# Altium schematic sheet USB_keyholder.SchDoc: Наименование
size 420 x 297 mm; ApprovedBy: Утвердил; CheckedBy: Проверил; Author: Разработал; CompanyName: Организация; DrawnBy: Н.Контр; Engineer: Т.Контр; SheetNumber: 1; SheetTotal: 1; PageSetup: Record=PageOptions|CenterHorizontal=True|CenterVertical=True|PrintScale=0.94|XCorrection=1.00|YCorrection=1.00|PrintKind=1|BorderSize=5000000|LeftOffset=0|BottomOffset=0|Orientation=1|PaperLength=1000|PaperWidth=1000|Scale=100|PaperSource=7|PrintQuality=-4|MediaType=1|DitherType=10|PaperKind=A4|PrintScaleMode=1; DecimalNumber: Децимальный номер; HeadOfSector: Нач. сектора; MainDevice: Перв.примен.; Name: Наименование; DocumentName: Sheet1.SCHDOC
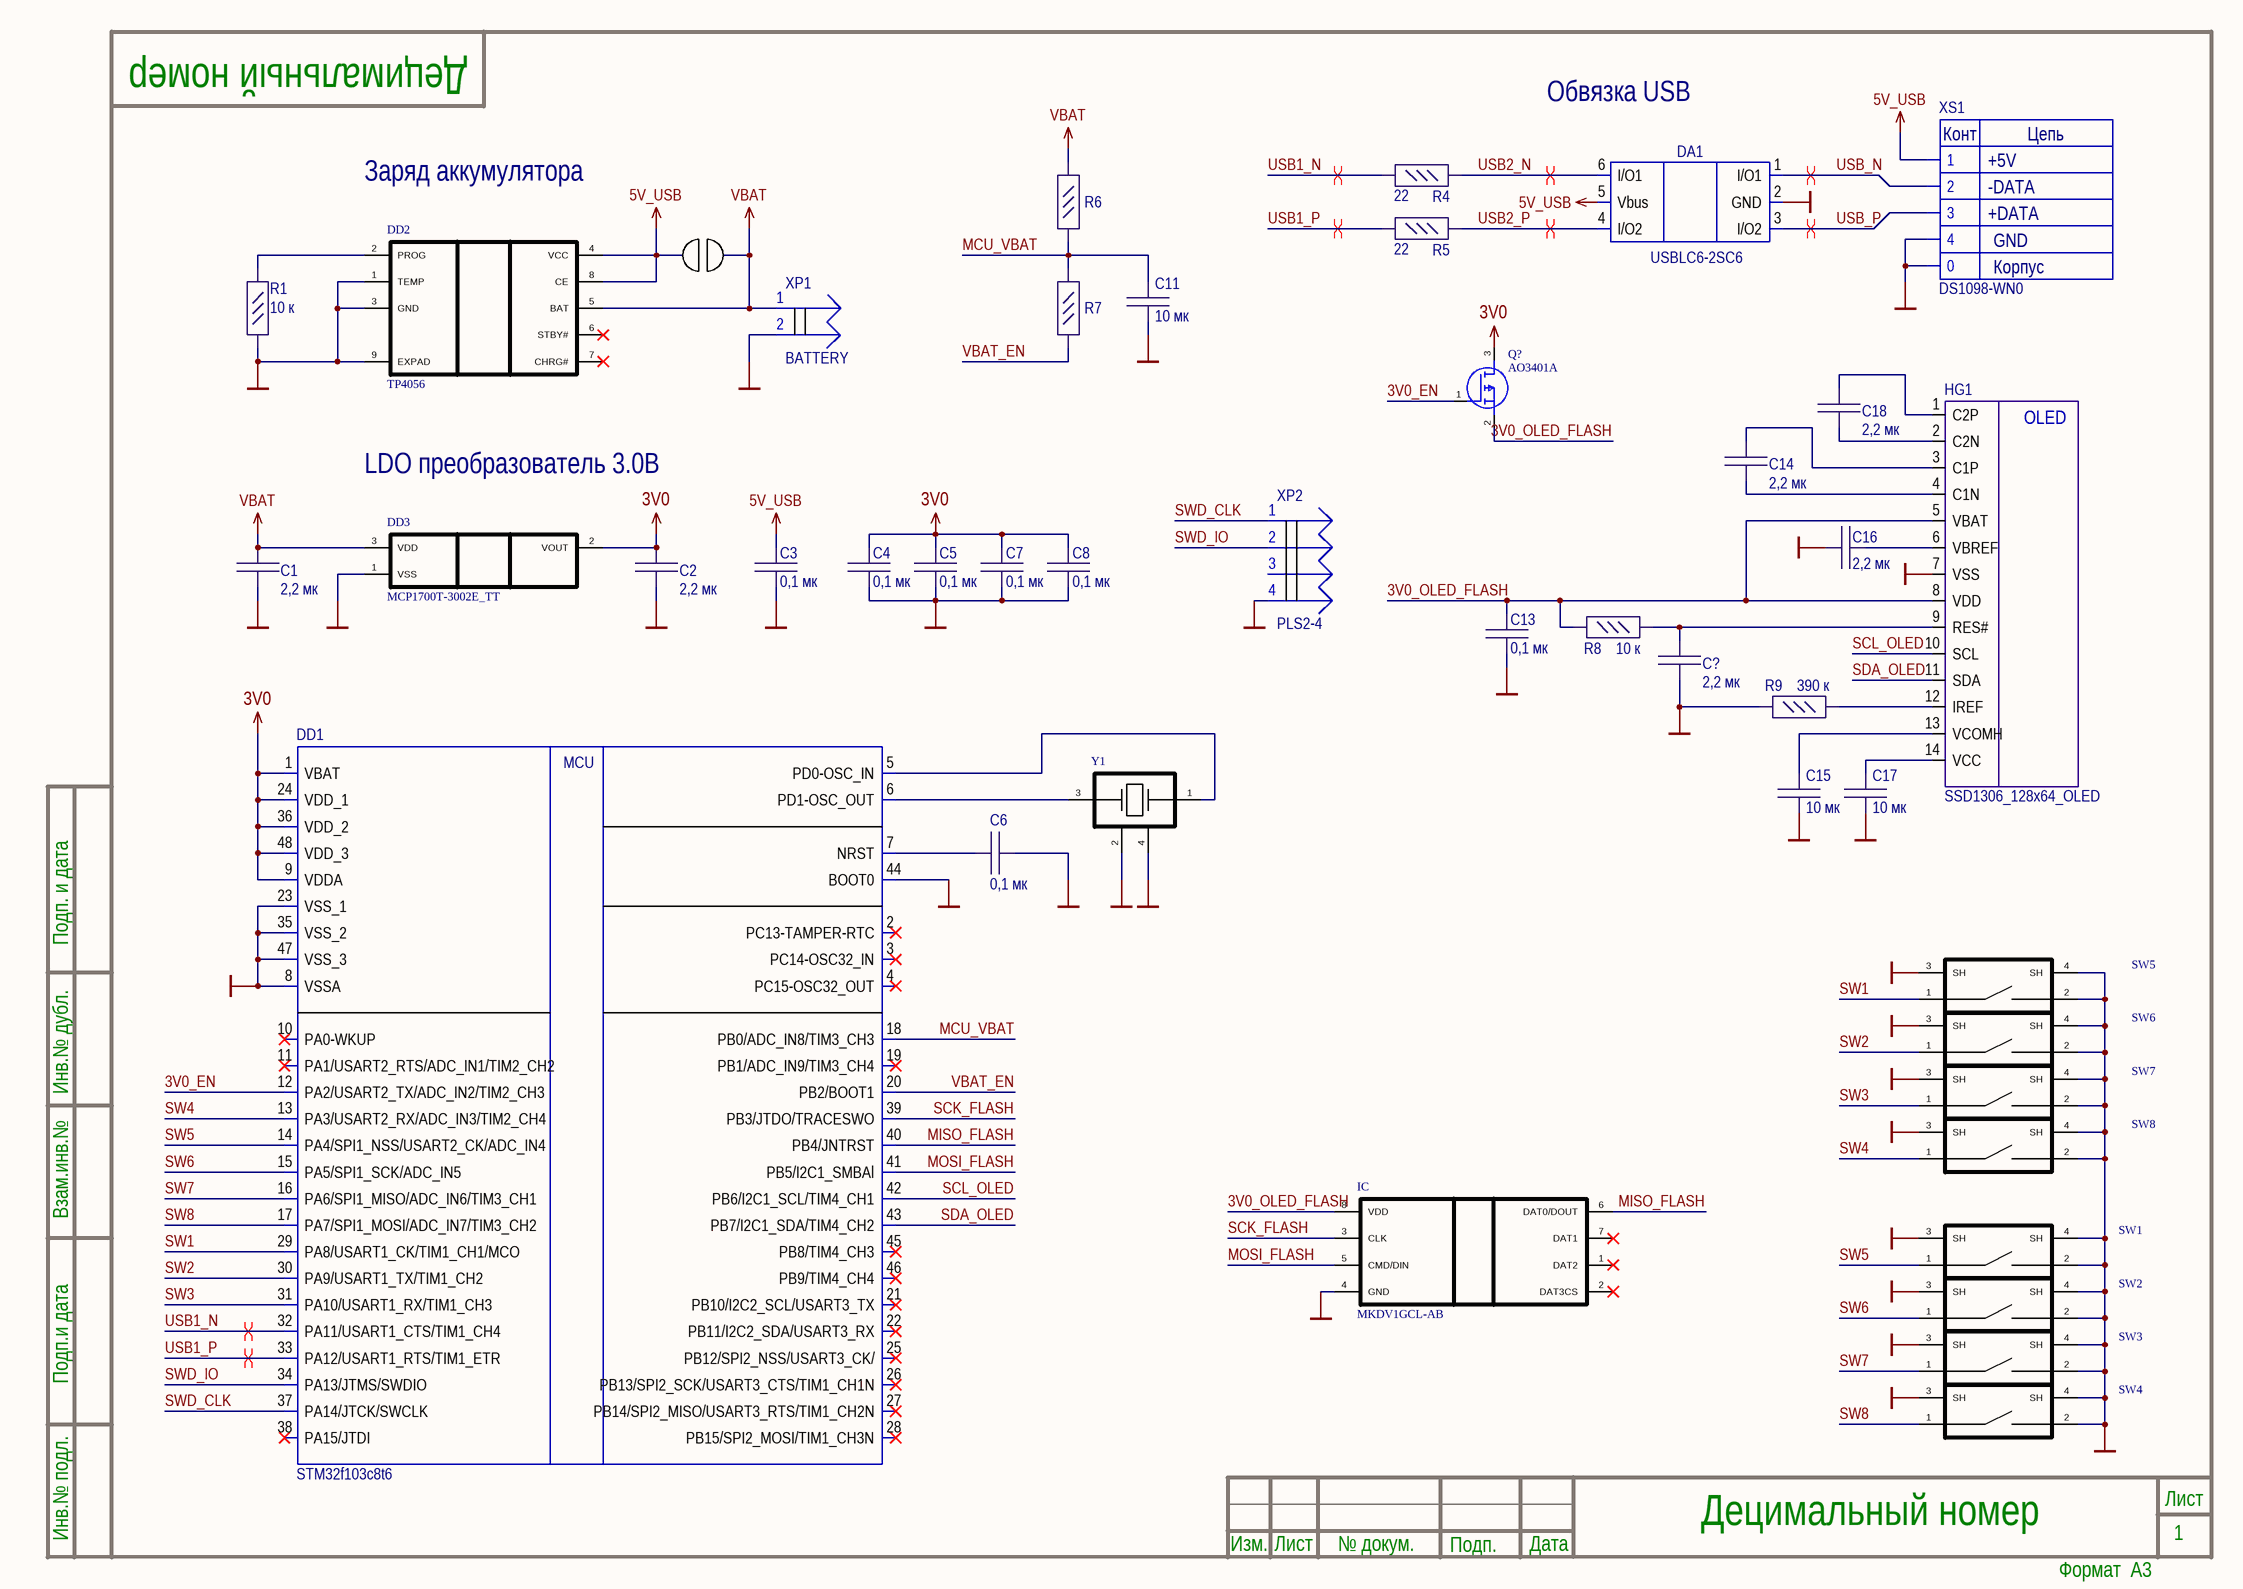
[diagram p0: USB_keyholder.SchDoc]

## Parts
C1  2,2 мк  [C_0603]
C2  2,2 мк  [C_0603]
C3  0,1 мк  [C_0603]
C4  0,1 мк  [C_0603]
C5  0,1 мк  [C_0603]
C6  0,1 мк  [C_0603]
C7  0,1 мк  [C_0603]
C8  0,1 мк  [C_0603]
C11  10 мк  [C_0603]
C13  0,1 мк  [C_0603]
C14  2,2 мк  [C_0603]
C15  10 мк  [C_0603]
C16  2,2 мк  [C_0603]
C17  10 мк  [C_0603]
C18  2,2 мк  [C_0603]
C?  2,2 мк  [C_0603]
DA1  USBLC6-2SC6  [SOT-23-6]
DD1  STM32f103c8t6  [LQFP48]
DD2  TP4056  [SOIC127P600X175-9N]
DD3  MCP1700T-3002E_TT  [SOT95P237X112-3N]
HG1  SSD1306_128х64_OLED  [14_pin_OLED]
IC  MKDV1GCL-AB  [SON127P800X600X80-8N]
Q?  AO3401A  [SOT95P280X125-3N]
R1  10 к  [R_0603]
R4  22  [R_0603]
R5  22  [R_0603]
R6  1 M  [R_0603]  (value not drawn)
R7  1 M  [R_0603]  (value not drawn)
R8  10 к  [R_0603]
R9  390 к  [R_0603]
SW1  TSA365G00D  [1TS002G26003500CT]  (value not drawn)
SW2  TSA365G00D  [1TS002G26003500CT]  (value not drawn)
SW3  TSA365G00D  [1TS002G26003500CT]  (value not drawn)
SW4  TSA365G00D  [1TS002G26003500CT]  (value not drawn)
SW5  TSA365G00D  [1TS002G26003500CT]  (value not drawn)
SW6  TSA365G00D  [1TS002G26003500CT]  (value not drawn)
SW7  TSA365G00D  [1TS002G26003500CT]  (value not drawn)
SW8  TSA365G00D  [1TS002G26003500CT]  (value not drawn)
X1  Solder_jumper  [Solder_jumper]  (value not drawn)
XP1  BATTERY  [PLS-2]
XP2  PLS2-4  [PLS2-4]
XS1  DS1098-WN0  [DS1098-WN0]
Y1  X322512MSB4SI  [X322512MSB4SI]  (value not drawn)

## Nets
3V0: C2.2 C4.2 C5.2 C7.2 C8.2 DD1.1(VBAT) DD1.9(VDDA) DD1.24(VDD_1) DD1.36(VDD_2) DD1.48(VDD_3) DD3.2(VOUT) Q?.3(D)
5V_USB: C3.2 DA1.5(Vbus) DD2.4(VCC) DD2.8(CE) X1.1 XS1.1
GND: C1.1 C2.1 C3.1 C4.1 C5.1 C6.1 C7.1 C8.1 C11.1 C13.1 C15.1 C16.2 C17.1 C?.1 DA1.2(GND) DD1.8(VSSA) DD1.23(VSS_1) DD1.35(VSS_2) DD1.44(BOOT0) DD1.47(VSS_3) DD2.1(TEMP) DD2.3(GND) DD2.9(EXPAD) DD3.1(VSS) HG1.7(VSS) IC.4(GND) R1.1 R9.1 SW1.2(VOUT) SW1.3(SH) SW1.4(SH) SW2.2(VOUT) SW2.3(SH) SW2.4(SH) SW3.2(VOUT) SW3.3(SH) SW3.4(SH) SW4.2(VOUT) SW4.3(SH) SW4.4(SH) SW5.2(VOUT) SW5.3(SH) SW5.4(SH) SW6.2(VOUT) SW6.3(SH) SW6.4(SH) SW7.2(VOUT) SW7.3(SH) SW7.4(SH) SW8.2(VOUT) SW8.3(SH) SW8.4(SH) XP1.2 XP2.4 XS1.0 XS1.4 Y1.2 Y1.4
VBAT: C1.2 DD2.5(BAT) DD3.3(VDD) R6.2 X1.2 XP1.1
3V0_EN: DD1.12(PA2/USART2_TX/ADC_IN2/TIM2_CH3) Q?.1(G)
3V0_OLED_FLASH: C13.2 HG1.5(VBAT) HG1.8(VDD) IC.8(VDD) Q?.2(S) R8.2
MCU_VBAT: C11.2 DD1.18(PB0/ADC_IN8/TIM3_CH3) R6.1 R7.2
MISO_FLASH: DD1.40(PB4/JNTRST) IC.6(DAT0/DOUT)
MOSI_FLASH: DD1.41(PB5/I2C1_SMBAl) IC.5(CMD/DIN)
SCK_FLASH: DD1.39(PB3/JTDO/TRACESWO) IC.3(CLK)
SCL_OLED: DD1.42(PB6/I2C1_SCL/TIM4_CH1) HG1.10(SCL)
SDA_OLED: DD1.43(PB7/I2C1_SDA/TIM4_CH2) HG1.11(SDA)
SW1: DD1.29(PA8/USART1_CK/TIM1_CH1/MCO) SW5.1(VSS)
SW2: DD1.30(PA9/USART1_TX/TIM1_CH2) SW6.1(VSS)
SW3: DD1.31(PA10/USART1_RX/TIM1_CH3) SW7.1(VSS)
SW4: DD1.13(PA3/USART2_RX/ADC_IN3/TIM2_CH4) SW8.1(VSS)
SW5: DD1.14(PA4/SPI1_NSS/USART2_CK/ADC_IN4) SW1.1(VSS)
SW6: DD1.15(PA5/SPI1_SCK/ADC_IN5) SW2.1(VSS)
SW7: DD1.16(PA6/SPI1_MISO/ADC_IN6/TIM3_CH1) SW3.1(VSS)
SW8: DD1.17(PA7/SPI1_MOSI/ADC_IN7/TIM3_CH2) SW4.1(VSS)
SWD_CLK: DD1.37(PA14/JTCK/SWCLK) XP2.1
SWD_IO: DD1.34(PA13/JTMS/SWDIO) XP2.2
USB1_N: DD1.32(PA11/USART1_CTS/TIM1_CH4) R4.1
USB1_P: DD1.33(PA12/USART1_RTS/TIM1_ETR) R5.1
USB2_N: DA1.6(I/O1) R4.2
USB2_P: DA1.4(I/O2) R5.2
USB_N: DA1.1(I/O1) XS1.2
USB_P: DA1.3(I/O2) XS1.3
VBAT_EN: DD1.20(PB2/BOOT1) R7.1
NetC6_2: C6.2 DD1.7(NRST)
NetC14_1: C14.1 HG1.4(C1N)
NetC14_2: C14.2 HG1.3(C1P)
NetC15_2: C15.2 HG1.13(VCOMH)
NetC16_1: C16.1 HG1.6(VBREF)
NetC17_2: C17.2 HG1.14(VCC)
NetC18_1: C18.1 HG1.2(C2N)
NetC18_2: C18.2 HG1.1(C2P)
NetC?_2: C?.2 HG1.9(RES#) R8.1
NetDD1_5: DD1.5(PD0-OSC_IN) Y1.1
NetDD1_6: DD1.6(PD1-OSC_OUT) Y1.3
NetDD2_2: DD2.2(PROG) R1.2
NetHG1_12: HG1.12(IREF) R9.2

Not connected (* = marked no-connect by the designer): DD1 2(PC13-TAMPER-RTC)* 3(PC14-OSC32_IN)* 4(PC15-OSC32_OUT)* 10(PA0-WKUP)* 11(PA1/USART2_RTS/ADC_IN1/TIM2_CH2)* 19(PB1/ADC_IN9/TIM3_CH4)* 21(PB10/I2C2_SCL/USART3_TX)* 22(PB11/I2C2_SDA/USART3_RX)* 25(PB12/SPI2_NSS/USART3_CK/)* 26(PB13/SPI2_SCK/USART3_CTS/TIM1_CH1N)* 27(PB14/SPI2_MISO/USART3_RTS/TIM1_CH2N)* 28(PB15/SPI2_MOSI/TIM1_CH3N)* 38(PA15/JTDI)* 45(PB8/TIM4_CH3)* 46(PB9/TIM4_CH4)*; DD2 6(STBY#)* 7(CHRG#)*; IC 1(DAT2)* 2(DAT3CS)* 7(DAT1)*; XP2 3

## Layout directives
differential pair: USB1_N, USB1_P, USB2_N, USB2_P, USB_N, USB_P

## Notes on the sheet
- Обвязка USB
- Заряд аккумулятора
- LDO преобразователь 3.0В
- Подп. и дата
- Инв.№ дубл.
- Взам.инв.№
- Подп.и дата
- Инв.№ подл.
- Изм.
- Лист
- № докум.
- Подп.
- Дата
- Формат  A3
- (in symbol DS1098-WN0) Конт; Цепь; +5V; -DATA; +DATA; GND; Корпус
- (in symbol SSD1306_128х64_OLED) OLED
- (in symbol STM32f103c8t6) MCU

## Library data of the parts
C1 C2 C14 C16 C18 C? = GRM188R61E225MA12D: CAP CER 2.2UF 25V X5R 0603; Manufacturer: Murata Electronics; Value: 2.2µF; Part Number: GRM188R61E225MA12D; ComponentLink1URL: https://search.murata.co.jp/Ceramy/image/img/A01X/G101/ENG/GRM188R61E225MA12-01.pdf; ComponentLink1Description: Datasheet; Component Type: Capasitor
C3-C8 C13 = GRM188R72A104MA35D: CAP CER 0.1UF 100V X7R 0603; Manufacturer: Murata Electronics; Value: 0.1µF; Part Number: GRM188R72A104MA35D; ComponentLink1URL: https://search.murata.co.jp/Ceramy/image/img/A01X/G101/ENG/GRM188R72A104MA35-01.pdf; ComponentLink1Description: Datasheet; Component Type: Capasitor
C11 C15 C17 = GRM188R61A106KE69J: CAP CER 10UF 10V X5R 0603; Manufacturer: Murata Electronics; Value: 10µF; Part Number: GRM188R61A106KE69J; ComponentLink1URL: https://search.murata.co.jp/Ceramy/image/img/A01X/G101/ENG/GRM188R61A106KE69-01.pdf; ComponentLink1Description: Datasheet; Component Type: Capasitor
DD2 = TP4056: Li Ion charger
IC = MKDV1GCL-AB: SPI/SDIO 1Gb flash; Manufacturer_Name: MK; Datasheet Link: https://datasheet.lcsc.com/lcsc/2110081830_MK-MKDV1GCL-AB_C2686055.pdf; Height: 0.8mm; Manufacturer_Part_Number: MKDV1GCL-AB
Q? = AO3401A: MOSFET (P-Channel); Manufacturer_Name: Alpha & Omega Semiconductors; Datasheet Link: http://www.aosmd.com/pdfs/datasheet/AO3401A.pdf; Height: 1.25mm; Manufacturer_Part_Number: AO3401A; Arrow Part Number: AO3401A; Arrow Price/Stock: https://www.arrow.com/en/products/ao3401a/alpha-and-omega-semiconductor?region=nac
R1 R8 = CR0603-FX-1002ELF: RES SMD 10K OHM 1% 1/10W 0603; Manufacturer: Bourns Inc.; Part Number: CR0603-FX-1002ELF; Value: 10 к; ComponentLink1URL: https://www.bourns.com/pdfs/chpreztr.pdf; ComponentLink1Description: Datasheet; Component Type: Resistor
R4 R5 = CR0603-FX-22R0ELF: RES SMD 22 OHM 1% 1/10W 0603; Manufacturer: Bourns Inc.; Part Number: CR0603-FX-22R0ELF; Value: 22; ComponentLink1URL: https://www.bourns.com/pdfs/chpreztr.pdf; ComponentLink1Description: Datasheet; Component Type: Resistor
R6 R7 = CR0603-FX-1004ELF: RES SMD 1M OHM 1% 1/10W 0603; Manufacturer: Bourns Inc.; Part Number: CR0603-FX-1004ELF; Value: 1 M; ComponentLink1URL: https://www.bourns.com/pdfs/chpreztr.pdf; ComponentLink1Description: Datasheet; Component Type: Resistor
R9 = CR0603-FX-3903ELF: RES SMD 390K OHM 1% 1/10W 0603; Manufacturer: Bourns Inc.; Part Number: CR0603-FX-3903ELF; Value: 390 к; ComponentLink1URL: https://www.bourns.com/pdfs/chpreztr.pdf; ComponentLink1Description: Datasheet; Component Type: Resistor
XP1 = PLS-2
Y1 = X322512MSB4SI: 8MHz Crystal resonator
DA1 = USBLC6-2SC6: HelpURL: https://static.chipdip.ru/lib/093/DOC001093117.pdf